# EAGLE schematic therm_bmp085 (EAGLE 8.1.0)
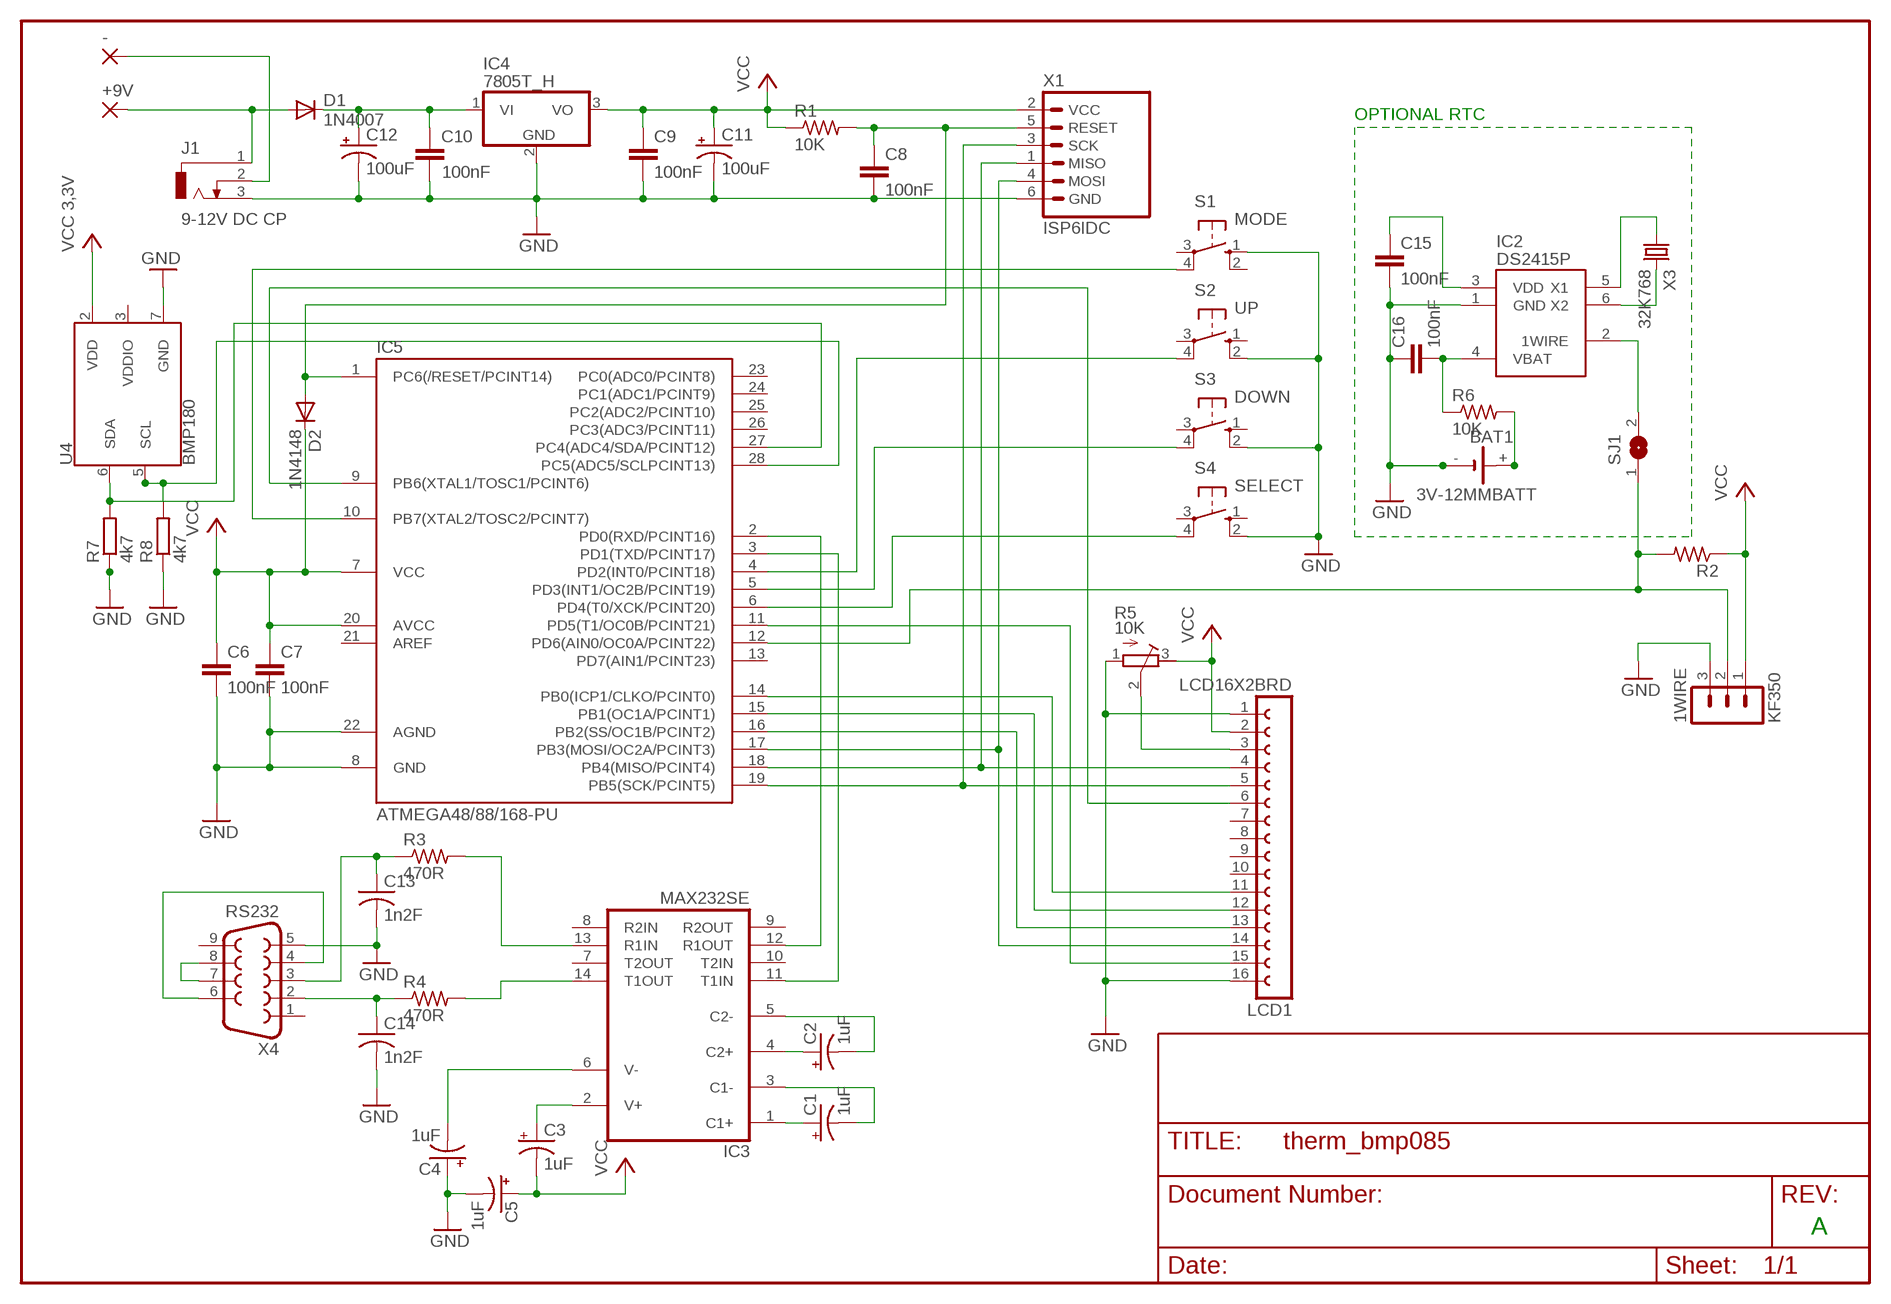
[diagram p0: schematic, sheet 1]

## Parts
1WIRE  KF350  [KF350]
+9V  WIREPAD3,17/1,1  [3,17/1,1]
-  WIREPAD3,17/1,1  [3,17/1,1]
BAT1  3V-12MMBATT  12MMBATT  [KEYELCO3001]
C1  1uF  CPOL-USCT3528  [CT3528]
C2  1uF  CPOL-USCT3528  [CT3528]
C3  1uF  CPOL-USCT3528  [CT3528]
C4  1uF  CPOL-USCT3528  [CT3528]
C5  1uF  CPOL-USCT3528  [CT3528]
C6  100nF  C-EUC0805  [C0805]
C7  100nF  C-EUC0805  [C0805]
C8  100nF  C-EUC0805  [C0805]
C9  100nF  C-EUC025_050-024X070  [C025_050-024X070]
C10  100nF  C-EUC025_050-024X070  [C025_050-024X070]
C11  100uF  CPOL-USE2.5-7  [E2,5-7]
C12  100uF  CPOL-USE2.5-7  [E2,5-7]
C13  1n2F  C-USC0805  [C0805]
C14  1n2F  C-USC0805  [C0805]
C15  100nF  C-EUC0805  [C0805]
C16  100nF  C-EUC0805  [C0805]
D1  1N4007  DIODE-D-10  [D-10]
D2  1N4148  BAS15  [DO34-7]
IC2  DS2415P  [TSOC6]
IC3  MAX232SE  [SO16]
IC4  7805T_H  [TO220H]
IC5  ATMEGA48/88/168-PU  [DIL28-3]
J1  9-12V DC CP  DCJ0202  [DCJ0202]
LCD1  LCD16X2BRD  [LCD16X2]
R1  10K  R-US_R0805  [R0805]
R2  R-US_0207/10  [0207/10]
R3  470R  R-US_R0805  [R0805]
R4  470R  R-US_R0805  [R0805]
R5  10K  R-TRIMM5X  [RTRIM5X]
R6  10K  R-US_R0805  [R0805]
R7  4k7  R-EU_0204/2V  [0204V]
R8  4k7  R-EU_0204/2V  [0204V]
S1  MODE  10-XX  [B3F-10XX]
S2  UP  10-XX  [B3F-10XX]
S3  DOWN  10-XX  [B3F-10XX]
S4  SELECT  10-XX  [B3F-10XX]
SJ1  SJ  [SJ]
U4  BMP180  [BMP180]
X1  ISP6IDC  [IDC-6]
X3  32K768  TC38_SMD  [TC38H_SMD]
X4  RS232  F09D  [F09D]

## Nets
+9V: +9V.1(P) D1.A J1.1
GND: 1WIRE.3 BAT1.- BAT1.-1 BAT1.-2 BAT1.-3 C4.+ C5.- C6.2 C7.2 C8.2 C9.2 C10.3 C11.- C12.- C13.2 C14.2 C15.2 C16.1 IC2.1(GND) IC4.2(GND) IC5.8(GND) IC5.22(AGND) J1.3 LCD1.1 LCD1.16 R5.1(E) R7.1 R8.1 S1.1(S) S2.2(S1) S3.2(S1) S4.2(S1) U4.7(GND) X1.6(GND) X4.5
N$1: IC5.27(PC4(ADC4/SDA/PCINT12)) IC5.28(PC5(ADC5/SCLPCINT13)) R7.2 R8.2 U4.5(SCL) U4.6(SDA)
N$2: C10.2 C12.+ D1.C IC4.1(VI)
N$3: C3.+ IC3.2(V+)
N$4: C4.- IC3.6(V-)
N$5: IC3.12(R1OUT) IC5.2(PD0(RXD/PCINT16))
N$6: IC3.11(T1IN) IC5.3(PD1(TXD/PCINT17))
N$7: C14.1 R4.1 X4.2
N$8: IC3.14(T1OUT) R4.2
N$9: C13.1 R3.1 X4.3
N$10: IC3.13(R1IN) R3.2
N$11: X4.7 X4.8
N$12: X4.4 X4.6
N$13: C1.+ IC3.1(C1+)
N$14: C1.- IC3.3(C1-)
N$15: C2.- IC3.5(C2-)
N$16: C2.+ IC3.4(C2+)
N$18: LCD1.3 R5.2(S)
N$19: IC5.10(PB7(XTAL2/TOSC2/PCINT7)) S1.4(P1)
N$20: IC5.9(PB6(XTAL1/TOSC1/PCINT6)) LCD1.6
N$21: IC5.19(PB5(SCK/PCINT5)) LCD1.5 X1.3(SCK)
N$22: IC5.18(PB4(MISO/PCINT4)) LCD1.4 X1.1(MISO)
N$23: IC5.17(PB3(MOSI/OC2A/PCINT3)) LCD1.14 X1.4(MOSI)
N$24: IC5.16(PB2(SS/OC1B/PCINT2)) LCD1.13
N$25: IC5.15(PB1(OC1A/PCINT1)) LCD1.12
N$26: IC5.14(PB0(ICP1/CLKO/PCINT0)) LCD1.11
N$27: IC5.11(PD5(T1/OC0B/PCINT21)) LCD1.15
N$28: IC5.4(PD2(INT0/PCINT18)) S2.4(P1)
N$29: IC5.5(PD3(INT1/OC2B/PCINT19)) S3.4(P1)
N$30: IC5.6(PD4(T0/XCK/PCINT20)) S4.4(P1)
N$31: 1WIRE.2 IC5.12(PD6(AIN0/OC0A/PCINT22)) R2.2 SJ1.1
N$32: IC2.6(X2) X3.P$2
N$33: IC2.5(X1) X3.P$1
N$35: C8.1 D2.A IC5.1(PC6(/RESET/PCINT14)) R1.2 X1.5(RESET)
N$37: -.1(P) J1.2
N$38: IC2.2(1WIRE) SJ1.2
N$40: C15.1 IC2.3(VDD)
N$41: BAT1.+ BAT1.+1 R6.2
VBAT: C16.2 IC2.4(VBAT) R6.1
VCC: 1WIRE.1 C3.- C5.+ C6.1 C7.1 C9.3 C11.+ D2.C IC4.3(VO) IC5.7(VCC) IC5.20(AVCC) LCD1.2 R1.1 R2.1 R5.3(A) U4.2(VDD) X1.2(VCC) ; supply symbol labelled VCC 3,3V
Unconnected: IC3.7(T2OUT) IC3.8(R2IN) IC3.9(R2OUT) IC3.10(T2IN) IC5.13(PD7(AIN1/PCINT23)) IC5.21(AREF) IC5.23(PC0(ADC0/PCINT8)) IC5.24(PC1(ADC1/PCINT9)) IC5.25(PC2(ADC2/PCINT10)) IC5.26(PC3(ADC3/PCINT11)) LCD1.7 LCD1.8 LCD1.9 LCD1.10 S1.2(S1) S1.3(P) S2.1(S) S2.3(P) S3.1(S) S3.3(P) S4.1(S) S4.3(P) X4.1 X4.9

## Notes on the sheet
- OPTIONAL RTC
- A

## Power pins joined to a net without a drawn wire
GND: IC3.15(GND)
VCC: IC3.16(VCC)
VDDIO: U4.3(VDDIO)

## Library data of the parts
1WIRE = blough:KF350: KEFA SCREW TERMINAL
+9V - = wirepad:WIREPAD: Wire PAD connect wire on PCB
BAT1 = blough:12MMBATT: 12mm Coin Cell - CR1220 or equiv
C1-C5 C11 C12 = rcl:CPOL-US: POLARIZED CAPACITOR, American symbol
C6-C10 C15 C16 = rcl:C-EU: CAPACITOR, European symbol
C13 C14 = rcl:C-US: CAPACITOR, American symbol
D1 = diode:DIODE-: DIODE
D2 = diode:BAS15: DIODE high speed
IC2 = blough:DS2415: 1-Wire Time Chip
IC3 = maxim:MAX232: RS232 TRANSEIVER
IC4 = linear:78*: Positive VOLTAGE REGULATOR Source: http://cache.national.com/ds/LM/LM78L05.pdf http://www.fairchildsemi.com/ds/LM/LM7805.pdf
IC5 = atmega8:ATMEGA48/88/168-PU
J1 = con-jack:DCJ0202: DC POWER JACK Source: DCJ0202.pdf
LCD1 = blough:LCD16X2: 16x2 LCD Connector with LCD Display Outline Insertion point is center of display
R1-R4 R6 = rcl:R-US_: RESISTOR, American symbol
R5 = rcl:R-TRIMM: Trimm resistor
R7 R8 = resistor:R-EU_: RESISTOR, European symbol
S1-S4 = switch-omron:10-XX: OMRON SWITCH; MPN: B3F-1000; OC_FARNELL: 176432; OC_NEWARK: 36M3542
SJ1 = jumper:SJ: SMD solder JUMPER
U4 = SparkFun-Sensors:BMP180: Bosch BMP180 Digital Barometric Pressures Sensor The BMP180 is the function compatible successor of the BMP085, a new generation of high precision digital pressure sensors for consumer applications. The ultra-low power, low voltage electronics of the BMP180 is optimized for use in mobile phones, PDAs, GPS navigation devices and outdoor equipment. With a low altitude noise of merely 0.25m at fast conversion time, the BMP180 offers superior performance. The I2C interface allows for easy system integration with a microcontroller. The BMP180 is based on piezo-resistive technology for EMC robustness, high accuracy and linearity as well as long term stability. Web page: http://www.bosch-sensortec.com/en/homepage/products_3/environmental_sensors_1/bmp180_1/bmp180 Datasheet: http://ae-bst.resource.bosch.com/media/products/dokumente/bmp180/BST-BMP180-DS000-09.pdf SparkFun Products Barometric Pressure Sensor - BMP180 <https://www.sparkfun.com/products/11823> (COM-11823) SparkFun Barometric Pressure Sensor Breakout - BMP180 <https://www.sparkfun.com/products/11824> (SEN-11824); PROD_ID: IC-11600; SF_ID: 11823
X1 = blough:ISP6: ATMEL 6-Pin ISP Connector
X3 = blough:TC38_SMD: TC38 Leaded Crystal with SMD pads
X4 = con-subd:F09: SUB-D